# Altium schematic sheet 03200904张晨05.SchDoc
size A4
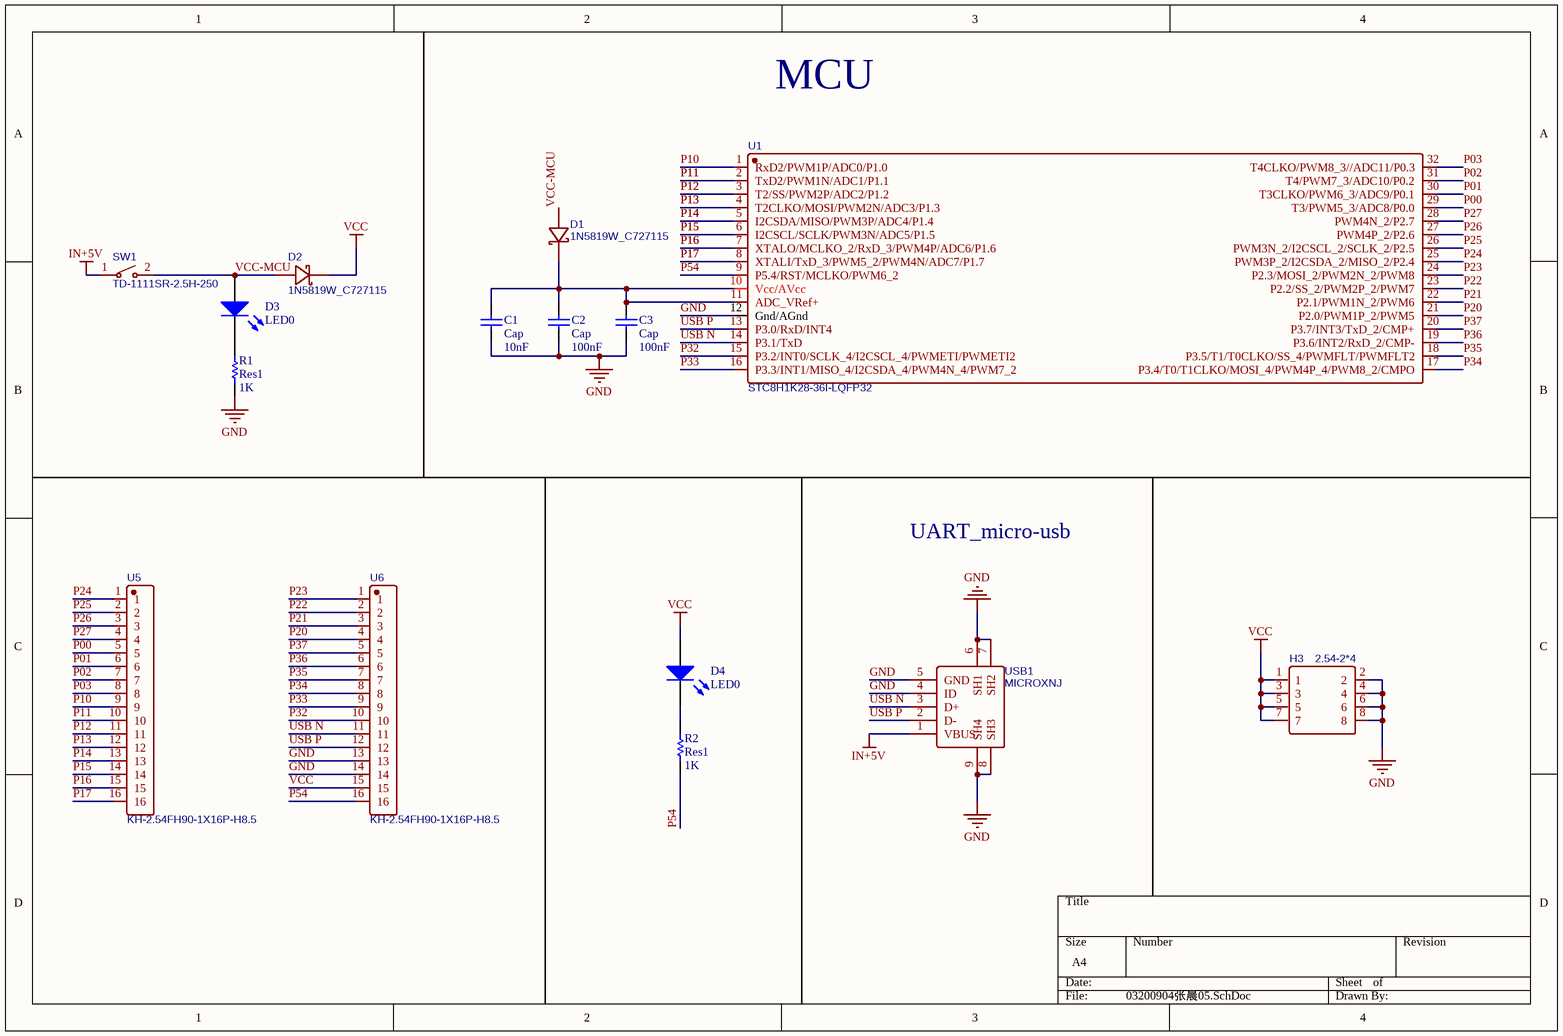
[diagram p0: 03200904张晨05.SchDoc]

## Parts
C1  Cap  value 10nF  [C0603]
C2  Cap  value 100nF  [C0603]
C3  Cap  value 100nF  [C0603]
D1  1N5819W_C727115  [SOD-123_L2.8-W1.8-LS3.7-RD]
D2  1N5819W_C727115  [SOD-123_L2.8-W1.8-LS3.7-RD]
D3  LED0  [LED0603]
D4  LED0  [LED0603]
H3  2.54-2*4  [HDR-TH_8P-P2.54-V-F-R2-C4-S2.54]
R1  Res1  value 1K  [R0603]
R2  Res1  value 1K  [R0603]
SW1  TD-1111SR-2.5H-250  [KEY-SMD_2P-L6.0-W3.6-P7.4-LS8.0-L]
U1  STC8H1K28-36I-LQFP32  [STC8H1K28I-LQFP-32]
U5  KH-2.54FH90-1X16P-H8.5  [HDR-TH_16P-P2.54-V-F-B]
U6  KH-2.54FH90-1X16P-H8.5  [HDR-TH_16P-P2.54-V-F-B]
USB1  MICROXNJ  [MICRO-USB-SMD_MICROXNJ]

## Nets
GND: C1.1 C2.1 C3.1 H3.2 H3.4 H3.6 H3.8 R1.1 U1.12(Gnd/AGnd) U6.13 U6.14 USB1.4(ID) USB1.5(GND) USB1.6(SH1) USB1.7(SH2) USB1.8(SH3) USB1.9(SH4)
IN+5V: SW1.1 USB1.1(VBUS)
VCC: D2.1(C) D4.2(A) H3.1 H3.3 H3.5 H3.7 U6.15
P00: U1.29(T3/PWM5_3/ADC8/P0.0) U5.5
P01: U1.30(T3CLKO/PWM6_3/ADC9/P0.1) U5.6
P02: U1.31(T4/PWM7_3/ADC10/P0.2) U5.7
P03: U1.32(T4CLKO/PWM8_3//ADC11/P0.3) U5.8
P10: U1.1(RxD2/PWM1P/ADC0/P1.0) U5.9
P11: U1.2(TxD2/PWM1N/ADC1/P1.1) U5.10
P12: U1.3(T2/SS/PWM2P/ADC2/P1.2) U5.11
P13: U1.4(T2CLKO/MOSI/PWM2N/ADC3/P1.3) U5.12
P14: U1.5(I2CSDA/MISO/PWM3P/ADC4/P1.4) U5.13
P15: U1.6(I2CSCL/SCLK/PWM3N/ADC5/P1.5) U5.14
P16: U1.7(XTALO/MCLKO_2/RxD_3/PWM4P/ADC6/P1.6) U5.15
P17: U1.8(XTALI/TxD_3/PWM5_2/PWM4N/ADC7/P1.7) U5.16
P20: U1.21(P2.0/PWM1P_2/PWM5) U6.4
P21: U1.22(P2.1/PWM1N_2/PWM6) U6.3
P22: U1.23(P2.2/SS_2/PWM2P_2/PWM7) U6.2
P23: U1.24(P2.3/MOSI_2/PWM2N_2/PWM8) U6.1
P24: U1.25(PWM3P_2/I2CSDA_2/MISO_2/P2.4) U5.1
P25: U1.26(PWM3N_2/I2CSCL_2/SCLK_2/P2.5) U5.2
P26: U1.27(PWM4P_2/P2.6) U5.3
P27: U1.28(PWM4N_2/P2.7) U5.4
P32: U1.15(P3.2/INT0/SCLK_4/I2CSCL_4/PWMETI/PWMETI2) U6.10
P33: U1.16(P3.3/INT1/MISO_4/I2CSDA_4/PWM4N_4/PWM7_2) U6.9
P34: U1.17(P3.4/T0/T1CLKO/MOSI_4/PWM4P_4/PWM8_2/CMPO) U6.8
P35: U1.18(P3.5/T1/T0CLKO/SS_4/PWMFLT/PWMFLT2) U6.7
P36: U1.19(P3.6/INT2/RxD_2/CMP-) U6.6
P37: U1.20(P3.7/INT3/TxD_2/CMP+) U6.5
P54: R2.1 U1.9(P5.4/RST/MCLKO/PWM6_2) U6.16
USB N: U1.14(P3.1/TxD) U6.11 USB1.3(D+)
USB P: U1.13(P3.0/RxD/INT4) U6.12 USB1.2(D-)
VCC-MCU: D1.2(A) D2.2(A) D3.2(A) SW1.2
NetC1_2: C1.2 C2.2 C3.2 D1.1(C) U1.10(Vcc/AVcc) U1.11(ADC_VRef+)
NetD3_1: D3.1(K) R1.2
NetD4_1: D4.1(K) R2.2

## Notes on the sheet
- MCU
- UART_micro-usb

## Library data of the parts
C1-C3 = Cap: Capacitor; Published: 8-Jun-2000; LatestRevisionDate: 17-Jul-2002; LatestRevisionNote: Re-released for DXP Platform.; PackageReference: RAD-0.3; Publisher: Altium Limited; PackageDescription: Radial Cap, Thru-Hole; 2 Leads; 0.3 in Pin Spacing
D1 D2 = 1N5819W_C727115: BOM_Manufacturer: TWGMC; Contributor: LCSC; BOM_Supplier: LCSC; BOM_Supplier Part: C727115; BOM_Manufacturer Part: 1N5819W; BOM_JLCPCB Part Class: Extended Part; spicePre: D; spiceSymbolName: 1N5819W_C727115
D3 D4 = LED: Typical INFRARED GaAs LED; Published: 8-Jun-2000; LatestRevisionDate: 08-Jul-2005; LatestRevisionNote: Mech Layer 1 removed.; PackageReference: LED-0; Publisher: Altium Limited; PackageDescription: LED; 2 Leads
H3 = 2.54-2*4: BOM_Manufacturer: ZHOURI(洲日); Contributor: LCSC; BOM_Supplier: LCSC; BOM_Supplier Part: C2977588; BOM_Manufacturer Part: 2.54-2*4; link: https://atta.szlcsc.com/upload/public/pdf/source/20220328/363EB391BC0EB759CF231FC910753CBE.pdf; spicePre: U; spiceSymbolName: 2.54-2*4
R1 R2 = Res: Resistor; Published: 8-Jun-2000; LatestRevisionDate: 17-Jul-2002; LatestRevisionNote: Re-released for DXP Platform.; PackageReference: AXIAL-0.3; Publisher: Altium Limited; PackageDescription: Axial Device, Thru-Hole; 2 Leads; 0.3 in Pin Spacing
SW1 = TD-1111SR-2.5H-250: BOM_Manufacturer: DEALON(德艺隆); Contributor: LCSC; BOM_Supplier: LCSC; BOM_Supplier Part: C2905157; BOM_Manufacturer Part: TD-1111SR-2.5H-250; spicePre: S; spiceSymbolName: TD-1111SR-2.5H-250
U1 = STC8H1K28-36I-LQFP32: BOM_Manufacturer: STC Micro; Contributor: LCSC; BOM_Supplier: LCSC; BOM_Supplier Part: C914618; BOM_Manufacturer Part: STC8H1K28-36I-LQFP32; BOM_JLCPCB Part Class: Extended Part; spicePre: U; spiceSymbolName: STC8H1K28-36I-LQFP32
U5 U6 = KH-2.54FH90-1X16P-H8.5: BOM_Manufacturer: kinghelm(金航标); Contributor: LCSC; BOM_Supplier: LCSC; BOM_Supplier Part: C2932686; BOM_Manufacturer Part: KH-2.54FH90-1X16P-H8.5; BOM_JLCPCB Part Class: Extended Part; spicePre: U; spiceSymbolName: KH-2.54FH90-1X16P-H8.5
USB1 = MICROXNJ: BOM_Manufacturer: SHOU HAN; Contributor: LCSC; BOM_Supplier: LCSC; BOM_Supplier Part: C404969; BOM_Manufacturer Part: MicroXNJ; BOM_JLCPCB Part Class: Extended Part; spicePre: U; spiceSymbolName: MICROXNJ